# EasyEDA Pro project ADA4530_2025-03-15.epro, schematic Schematic3
Board Name: SiPD+运放+供电; Create Date: 2024-12-24; Page Name: P1; Project Name: yuhuiceshi; Schematic Name: Schematic3; Update Date: 2025-03-02; Company: 嘉立创EDA; Page Size: A4; Version: V1.0
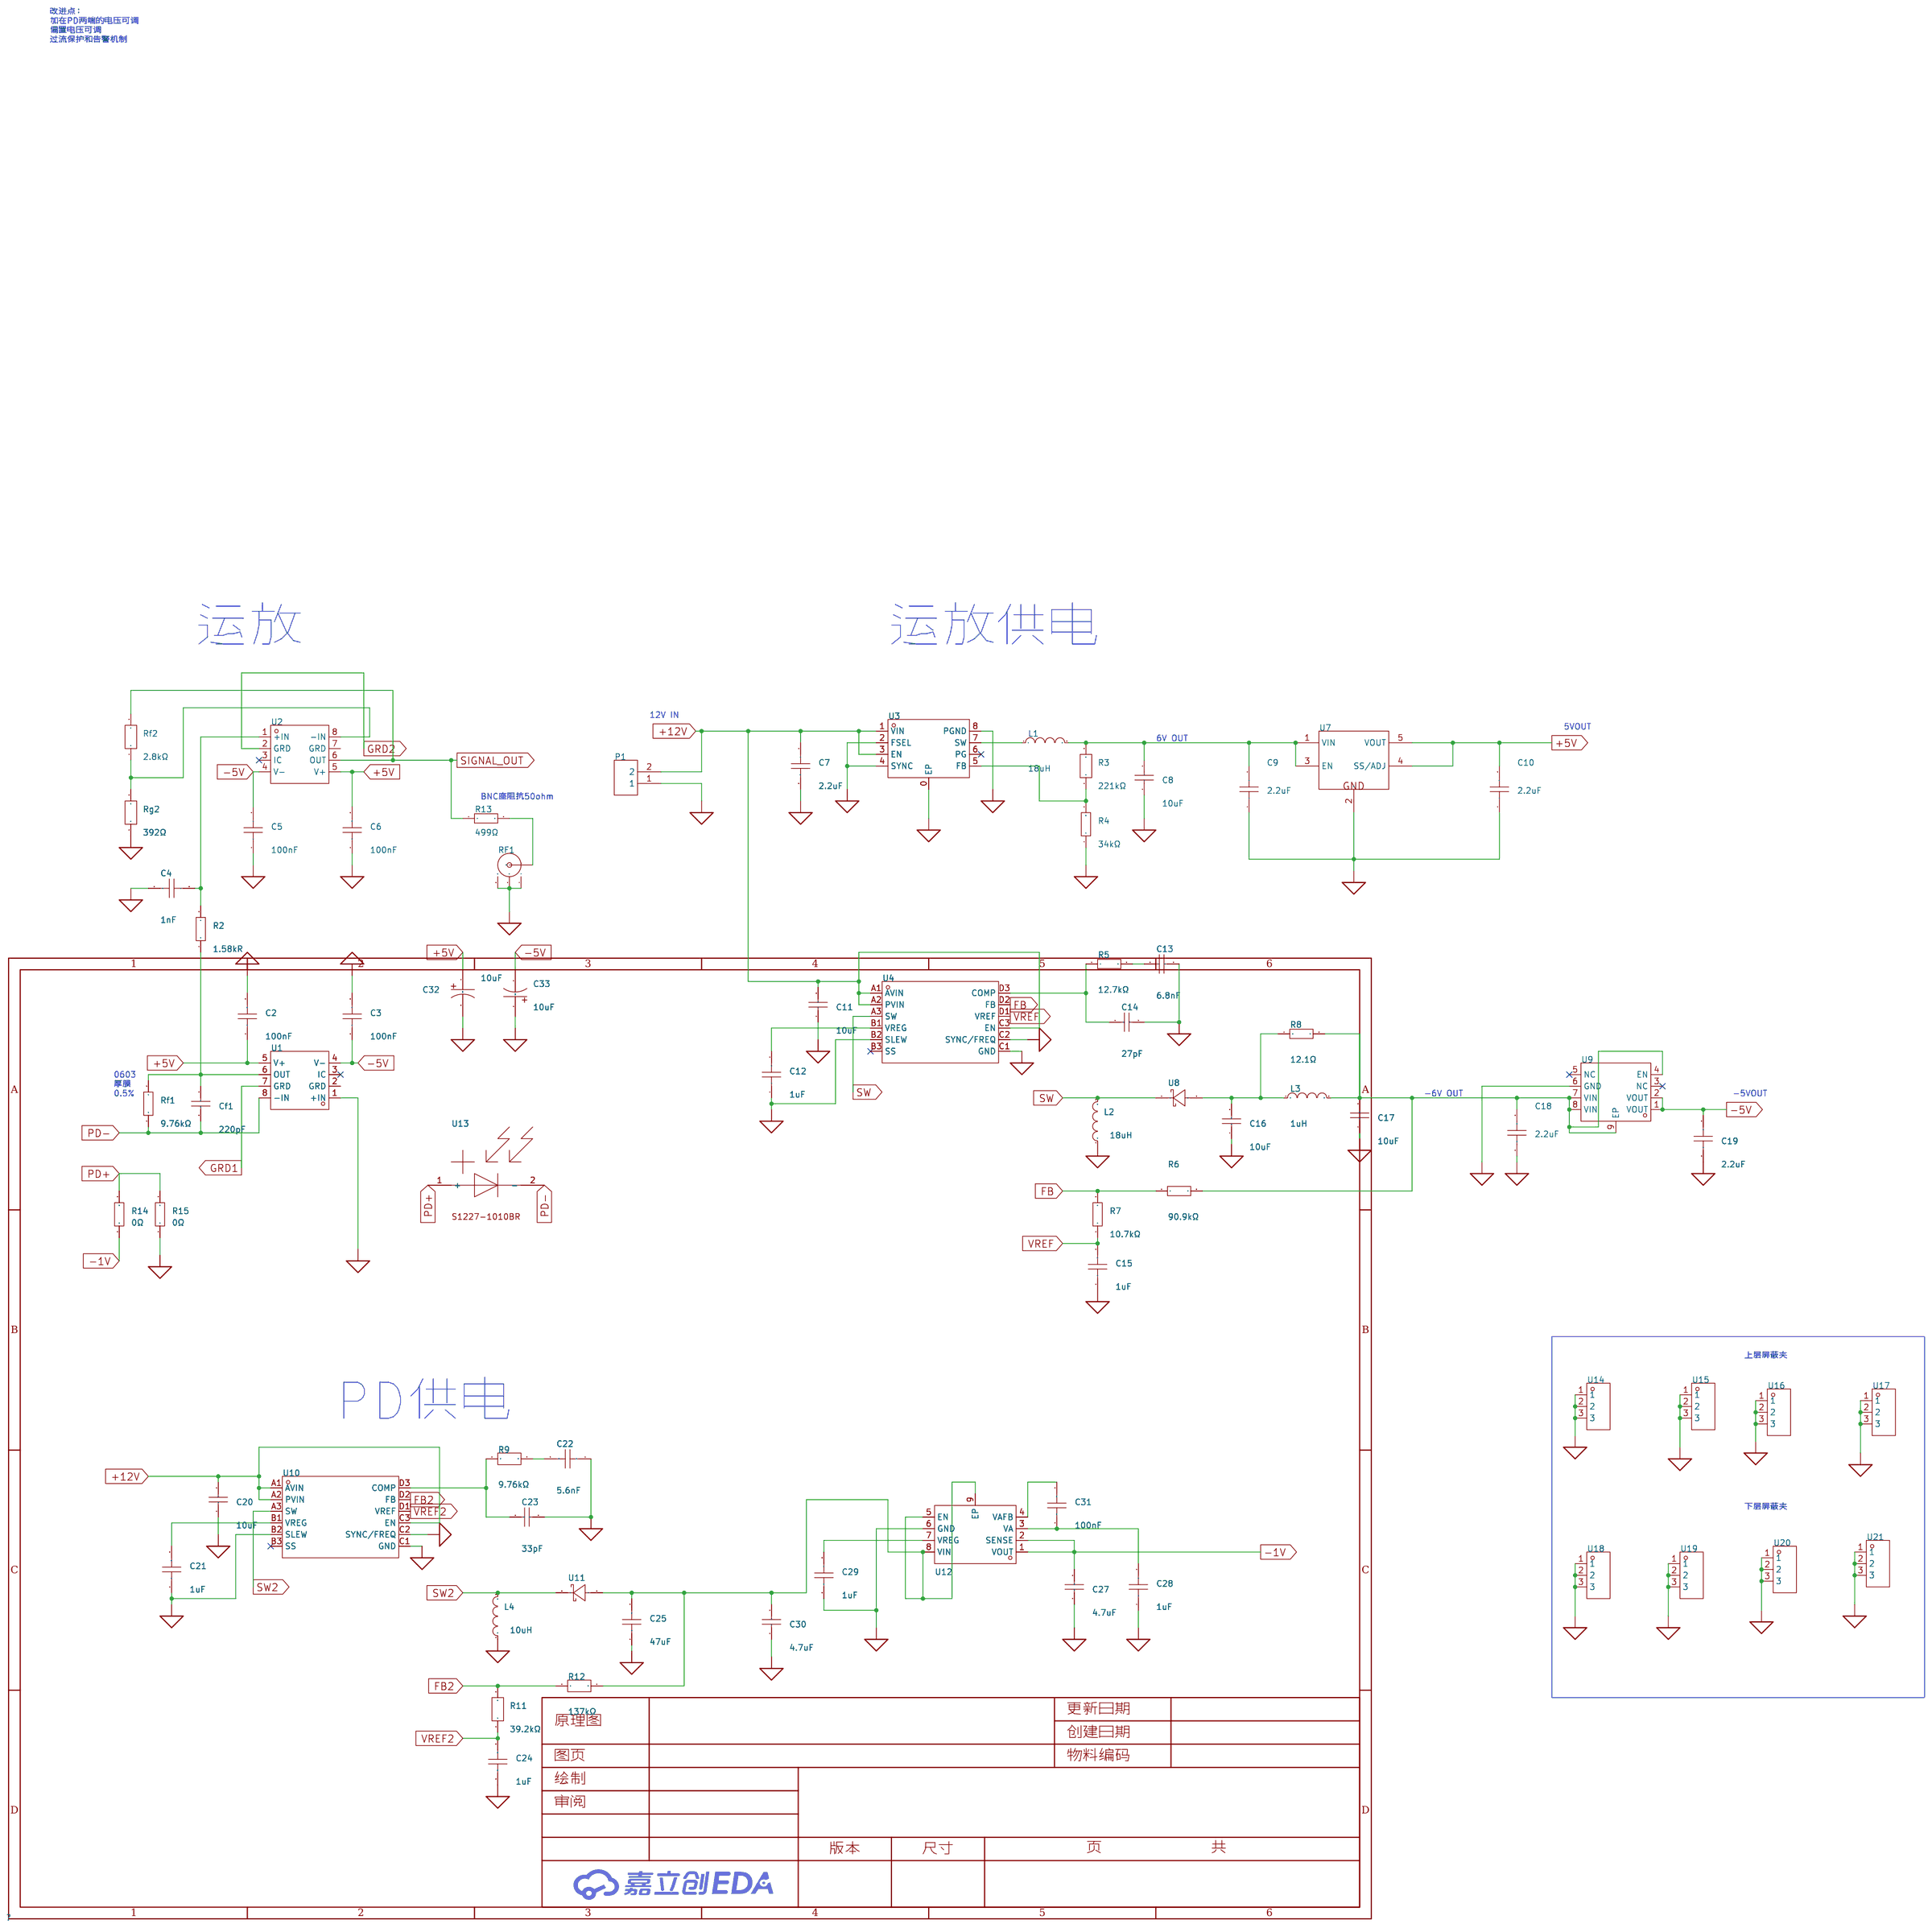
[diagram p3: schematic sheet]

## Parts
C2  100nF  [C0603]
C3  100nF  [C0603]
C4  1nF  [C0603]
C5  100nF  [C0603]
C6  100nF  [C0603]
C7  2.2uF  [C0805]
C8  10uF  [C1206]
C9  2.2uF  [C0805]
C10  2.2uF  [C0805]
C11  10uF  [C1206]
C12  1uF  [C0603]
C13  6.8nF  [C0402]
C14  27pF  [C0402]
C15  1uF  [C0603]
C16  10uF  [C1206]
C17  10uF  [C1206]
C18  2.2uF  [C0805]
C19  2.2uF  [C0805]
C20  10uF  [C1206]
C21  1uF  [C0603]
C22  5.6nF  [C0402]
C23  33pF  [C0402]
C24  1uF  [C0603]
C25  47uF  [C1206]
C27  4.7uF  [C0603]
C28  1uF  [C0603]
C29  1uF  [C0603]
C30  4.7uF  [C0603]
C31  100nF  [C0603]
C32  10uF  [CAP-SMD_L6.0-W3.2]
C33  10uF  [CAP-SMD_L6.0-W3.2]
Cf1  220pF  [C0603]
L1  18uH  [IND-SMD_L12.7-W12.7]
L2  18uH  [IND-SMD_L7.8-W7.0]
L3  1uH  [IND-SMD_L4.4-W4.2]
L4  10uH  [IND-SMD_L7.3-W6.8]
P1  WJ500V-5.08-2P  [CONN-TH_2P-P5.00_WJ500V-5.08-2P]
R2  1.58kR  [R0603]
R3  221kΩ  [R0603]
R4  34kΩ  [R0603]
R5  12.7kΩ  [R0402]
R6  90.9kΩ  [R0402]
R7  10.7kΩ  [R0402]
R8  12.1Ω  [R0402]
R9  9.76kΩ  [R0402]
R11  39.2kΩ  [R0402]
R12  137kΩ  [R0402]
R13  499Ω  [R0603]
R14  0Ω  [R0603]
R15  0Ω  [R0603]
RF1  KH-BNC50-3511  [ANT-TH_KH-BNC50-3511]
Rf1  9.76kΩ  [R0603]
Rf2  2.8kΩ  [R0603]
Rg2  392Ω  [R0603]
U1  ADA4530-1ARZ  [SOIC-8_L4.9-W3.9-P1.27-LS6.0-BL]
U2  ADA4530-1ARZ  [SOIC-8_L4.9-W3.9-P1.27-LS6.0-BL]
U3  ADP2370ACPZ-R7  [LFCSP-8_L3.0-W3.0-P0.50-BL-EP_ADP2370ACPZ-R7]
U4  ADP5075ACBZ-R7  [WLCSP-12_L2.2-W1.6_ADP5075ACBZ-R7]
U7  ADP7118AUJZ-5.0-R7  [SOT-23-5_L3.0-W1.7-P0.95-LS2.8-BR]
U8  MBR0520L  [SOD-123_L2.7-W1.6-LS3.7-RD-1]
U9  ADP7182ACPZ-5.0-R7  [LFCSP-8_L3.0-W3.0-P0.50-BL-EP-1]
U10  ADP5075ACBZ-R7  [WLCSP-12_L2.2-W1.6_ADP5075ACBZ-R7]
U11  MBR0520L  [SOD-123_L2.7-W1.6-LS3.7-RD-1]
U12  ADP7185ACPZN1.0-R7  [LFCSP-8_L2.0-W2.0-P0.50-BL-EP]
U13  -  [S1227-1010BR]
U14  ICSRC6508-030SFR  [SMD-3P_L6.5-W0.8_ICSRC6508-030SFR]
U15  ICSRC6508-030SFR  [SMD-3P_L6.5-W0.8_ICSRC6508-030SFR]
U16  ICSRC6508-030SFR  [SMD-3P_L6.5-W0.8_ICSRC6508-030SFR]
U17  ICSRC6508-030SFR  [SMD-3P_L6.5-W0.8_ICSRC6508-030SFR]
U18  ICSRC6508-030SFR  [SMD-3P_L6.5-W0.8_ICSRC6508-030SFR]
U19  ICSRC6508-030SFR  [SMD-3P_L6.5-W0.8_ICSRC6508-030SFR]
U20  ICSRC6508-030SFR  [SMD-3P_L6.5-W0.8_ICSRC6508-030SFR]
U21  ICSRC6508-030SFR  [SMD-3P_L6.5-W0.8_ICSRC6508-030SFR]

## Library data of the parts
C2 C3 C5 C6 C31 = CC0603KRX7R9BB104: 容值:100nF;精度:±10%;额定电压:50V;材质(温度系数):X7R;; LCSC Part Name: 100nF ±10% 50V; Supplier Part: C14663; Manufacturer: YAGEO(国巨); Supplier Footprint: 0603; JLCPCB Part Class: 基础库; Datasheet: https://atta.szlcsc.com/upload/public/pdf/source/20180910/C282072_33301C7F631E79921B82A8DAC6BCC5B3.pdf; Supplier: LCSC; Tolerance: ±10%; Voltage Rated: 50V; Temperature Coefficient: X7R
C4 = GRM1885C1H102JA01D: 容值:1nF;精度:±5%;额定电压:50V;材质(温度系数):C0G;; LCSC Part Name: 1nF ±5% 50V; Supplier Part: C77026; Manufacturer: muRata(村田); Supplier Footprint: 0603; JLCPCB Part Class: 扩展库; Datasheet: https://atta.szlcsc.com/upload/public/pdf/source/20200305/C490387_23319AE8C154DEB24C505E6C82A8106A.pdf; Supplier: LCSC; Tolerance: ±5%; Voltage Rated: 50V; Temperature Coefficient: C0G
C7 C9 C10 C18 C19 = CL21A225KBQNNNE: 容值:2.2uF;精度:±10%;额定电压:50V;材质(温度系数):X5R;; LCSC Part Name: 2.2uF ±10% 50V; Supplier Part: C377773; Manufacturer: SAMSUNG(三星); Supplier Footprint: 0805; JLCPCB Part Class: 基础库; Datasheet: https://atta.szlcsc.com/upload/public/pdf/source/20160218/1457707763339.pdf; Supplier: LCSC; Tolerance: ±10%; Voltage Rated: 50V; Temperature Coefficient: X5R
C8 C11 C16 C17 C20 = CL31A106KAHNNNE: 容值:10uF;精度:±10%;额定电压:25V;材质(温度系数):X5R;; LCSC Part Name: 10uF ±10% 25V; Supplier Part: C9807; Manufacturer: SAMSUNG(三星); Supplier Footprint: 1206; JLCPCB Part Class: 扩展库; Datasheet: https://atta.szlcsc.com/upload/public/pdf/source/20160218/1457707763339.pdf; Supplier: LCSC; Tolerance: ±10%; Voltage Rated: 25V; Temperature Coefficient: X5R
C12 C15 C21 C24 C28 C29 = CGA0603X5R105K160JT: 容值:1uF;精度:±10%;额定电压:16V;材质(温度系数):X5R;; LCSC Part Name: 1uF ±10% 16V; Supplier Part: C6119849; Manufacturer: HRE(芯声); Supplier Footprint: 0603; JLCPCB Part Class: 扩展库; Supplier: LCSC; Tolerance: ±10%; Voltage Rated: 16V; Temperature Coefficient: X5R
C13 = CC0402KRX7R9BB682: 容值:6.8nF;精度:±10%;额定电压:50V;材质(温度系数):X7R;; LCSC Part Name: 6.8nF ±10% 50V; Supplier Part: C93654; Manufacturer: YAGEO(国巨); Supplier Footprint: 0402; JLCPCB Part Class: 扩展库; Datasheet: https://atta.szlcsc.com/upload/public/pdf/source/20181008/C309510_22F155564471FAF6A489F7D68F34234E.pdf; Supplier: LCSC; Tolerance: ±10%; Voltage Rated: 50V; Temperature Coefficient: X7R
C14 = GCM1555C1H270JA16D: 容值:27pF;精度:±5%;额定电压:50V;材质(温度系数):C0G;; LCSC Part Name: 27pF ±5% 50V; Supplier Part: C126504; Manufacturer: muRata(村田); Supplier Footprint: 0402; JLCPCB Part Class: 扩展库; Datasheet: https://atta.szlcsc.com/upload/public/pdf/source/20170912/C126504_1505207897130963601.pdf; Supplier: LCSC; Tolerance: ±5%; Voltage Rated: 50V; Temperature Coefficient: C0G
C22 = CC0402KRX7R9BB562: 容值:5.6nF;精度:±10%;额定电压:50V;材质(温度系数):X7R;; LCSC Part Name: 5.6nF ±10% 50V; Supplier Part: C281760; Manufacturer: YAGEO(国巨); Supplier Footprint: 0402; JLCPCB Part Class: 扩展库; Datasheet: https://atta.szlcsc.com/upload/public/pdf/source/20180910/C282072_33301C7F631E79921B82A8DAC6BCC5B3.pdf; Supplier: LCSC; Tolerance: ±10%; Voltage Rated: 50V; Temperature Coefficient: X7R
C23 = CC0402JRNPO9BN330: 容值:33pF;精度:±5%;额定电压:50V;材质(温度系数):NP0;; LCSC Part Name: 33pF ±5% 50V; Supplier Part: C107005; Manufacturer: YAGEO(国巨); Supplier Footprint: 0402; JLCPCB Part Class: 扩展库; Datasheet: https://atta.szlcsc.com/upload/public/pdf/source/20181008/C309499_21CC21451B82C39E3D92150FD6B30293.pdf; Supplier: LCSC; Tolerance: ±5%; Voltage Rated: 50V; Temperature Coefficient: NP0
C25 = CGA1206X5R476M250NT: 容值:47uF;精度:±20%;额定电压:25V;材质(温度系数):X5R;; LCSC Part Name: 47uF ±20% 25V; Supplier Part: C6119973; Manufacturer: HRE(芯声); Supplier Footprint: 1206; JLCPCB Part Class: 扩展库; Datasheet: https://atta.szlcsc.com/upload/public/pdf/source/20240229/85D0248657B5565B358B20AFC8F32D04.pdf; Supplier: LCSC; Tolerance: ±20%; Voltage Rated: 25V; Temperature Coefficient: X5R
C27 C30 = CL10A475KO8NNNC: 容值:4.7uF;精度:±10%;额定电压:16V;材质(温度系数):X5R;; LCSC Part Name: 4.7uF ±10% 16V; Supplier Part: C19666; Manufacturer: SAMSUNG(三星); Supplier Footprint: 0603; JLCPCB Part Class: 基础库; Datasheet: https://atta.szlcsc.com/upload/public/pdf/source/20160218/1457707763339.pdf; Supplier: LCSC; Tolerance: ±10%; Voltage Rated: 16V; Temperature Coefficient: X5R
C32 C33 = TPSC106M025R0500: 容值:10uF;精度:±20%;额定电压:25V;等效串联电阻:500mΩ@100kHz;; LCSC Part Name: 10uF ±20% 25V; Supplier Part: C308883; Manufacturer: Kyocera AVX; Supplier Footprint: CASE-C-6032; JLCPCB Part Class: 扩展库; Datasheet: https://atta.szlcsc.com/upload/public/pdf/source/20190621/C308909_9D37C5E2EC8949438110162F4533A132.pdf; Supplier: LCSC; Tolerance: ±20%; Rated Voltage: 25V; Equivalent Series Resistance(ESR): 500mΩ@100kHz; Operating Temperature: -55℃~+125℃
Cf1 = CL10C221JB8NNNC: 容值:220pF;精度:±5%;额定电压:50V;材质(温度系数):C0G;; LCSC Part Name: 220pF ±5% 50V; Supplier Part: C27675; Manufacturer: SAMSUNG(三星); Supplier Footprint: 0603; JLCPCB Part Class: 扩展库; Datasheet: https://atta.szlcsc.com/upload/public/pdf/source/20160218/1457707763339.pdf; Supplier: LCSC; Tolerance: ±5%; Voltage Rated: 50V; Temperature Coefficient: C0G
L1 = SRR1208-180ML: 电感值:18uH;精度:±20%;额定电流:3.8A;饱和电流(Isat):4A;类型:-;; LCSC Part Name: 18uH ±20% 4A; Supplier Part: C1331002; Manufacturer: BOURNS; Supplier Footprint: SMD,12.7x12.7mm; JLCPCB Part Class: 扩展库; Datasheet: https://atta.szlcsc.com/upload/public/pdf/source/20210611/27EB3296191C192B2696E5AAF504BCA4.pdf; Supplier: LCSC; Tolerance: ±20%; Rated Current: 3.8A; Saturation Current (Isat): 4A; DC Resistance (DCR): 40mΩ
L2 = PCD0705MT180: 电感值:18uH;精度:±20%;额定电流:1.6A;; LCSC Part Name: 18uH ±20%; Supplier Part: C324432; Manufacturer: Viking(光颉); Supplier Footprint: SMD,7.8x7mm; JLCPCB Part Class: 扩展库; Datasheet: https://atta.szlcsc.com/upload/public/pdf/source/20190222/C324465_D652D0977146414A08B59C9C08C2344A.pdf; Supplier: LCSC; Tolerance: ±20%; Rated Current: 1.6A; DC Resistance (DCR): 100mΩ
L3 = FXL0420-1R0-M: 电感值:1uH;精度:±20%;额定电流:6A;饱和电流(Isat):7A;类型:一体成型电感;; LCSC Part Name: 1uH ±20% 7A; Supplier Part: C167203; Manufacturer: cjiang(长江微电); Supplier Footprint: SMD,4.2x4.4mm; JLCPCB Part Class: 扩展库; Datasheet: https://atta.szlcsc.com/upload/public/pdf/source/20240426/3189EA8206330E2108542F9E34E540E7.pdf; Supplier: LCSC; Tolerance: ±20%; Rated Current: 6A; Saturation Current (Isat): 7A; DC Resistance (DCR): 27mΩ; Type: 一体成型电感
L4 = FXL0630-100-M: 电感值:10uH;精度:±20%;额定电流:4.5A;饱和电流(Isat):5.5A;类型:一体成型电感;; LCSC Part Name: 10uH ±20% 5.5A; Supplier Part: C167223; Manufacturer: cjiang(长江微电); Supplier Footprint: SMD,6.6x7mm; JLCPCB Part Class: Extended Part; Datasheet: https://atta.szlcsc.com/upload/public/pdf/source/20240426/3189EA8206330E2108542F9E34E540E7.pdf; Supplier: LCSC; Tolerance: ±20%; Rated Current: 4.5A; Saturation Current (Isat): 5.5A; DC Resistance (DCR): 68mΩ; Type: 一体成型电感
P1 = WJ500V-5.08-2P: 结构:1x2P;间距:5.08mm;颜色:绿色;安装方式:直插;额定电流:18A;额定电压:250V;排数:1;线规 - AWG:14~30;线规 - 平方毫米:2.5;每排PIN数:2;触头材质:-;触头镀层:-;工作温度范围:-40℃~+105℃;焊接温度(最大值):-;; LCSC Part Name: 1x2P 5.08mm 直插 排数:1 每排P数:2; Supplier Part: C8465; Manufacturer: KANGNEX(康奈克斯电气); Supplier Footprint: 插件,P=5.08mm; JLCPCB Part Class: 扩展库; Datasheet: https://atta.szlcsc.com/upload/public/pdf/source/20191225/C8465_02D34CE5B5B4A53DF5891601D97FA9F4.pdf; Supplier: LCSC; Structure: 1x2P; Pitch: 5.08mm; Color: 绿色; Mounting Style: 直插; Current Rating (Max): 18A; Voltage Rating (Max): 250V; Number of Pins: 2P; Number of Rows: 1; Wire Gauge - AWG: 14~30; Wire Gauge - mm2: 2.5; Number of PINs Per Row: 2; Operating Temperature Range: -40℃~+105℃; Screw Specification: M2.5
R2 = Res_0603: 0.5%; Supplier Footprint: 0603; Supplier Part: C861202
R3 = FRC0603F2213TS: 电阻类型:厚膜电阻;阻值:221kΩ;精度:±1%;功率:100mW;温度系数:±100ppm/℃;; LCSC Part Name: 厚膜电阻 221kΩ ±1% 100mW; Supplier Part: C7467463; Manufacturer: FOJAN(富捷); Supplier Footprint: 0603; JLCPCB Part Class: 扩展库; Datasheet: https://atta.szlcsc.com/upload/public/pdf/source/20211221/9022FBEBBD509006A57EBC43C1F2F40C.pdf; Supplier: LCSC; Type: 厚膜电阻; Tolerance: ±1%; Power(Watts): 100mW; Temperature Coefficient: ±100ppm/℃
R4 = 0603WAF3402T5E: 电阻类型:厚膜电阻;阻值:34kΩ;精度:±1%;功率:100mW;最大工作电压:75V;温度系数:±100ppm/℃;; LCSC Part Name: 34kΩ ±1% 100mW 厚膜电阻; Supplier Part: C23008; Manufacturer: UNI-ROYAL(厚声); Supplier Footprint: 0603; JLCPCB Part Class: 扩展库; Datasheet: https://atta.szlcsc.com/upload/public/pdf/source/20200306/C422600_1E6D84923E4A46A82E41ADD87F860B5C.pdf; Supplier: LCSC; Type: 厚膜电阻; Tolerance: ±1%; Power(Watts): 100mW; Overload Voltage (Max): 75V; Temperature Coefficient: ±100ppm/℃; Operating Temperature Range: -55℃~+155℃
R5 = 0402WGF1272TCE: 电阻类型:厚膜电阻;阻值:12.7kΩ;精度:±1%;功率:62.5mW;最大工作电压:50V;温度系数:±100ppm/℃;; LCSC Part Name: 12.7kΩ ±1% 62.5mW 厚膜电阻; Supplier Part: C25853; Manufacturer: UNI-ROYAL(厚声); Supplier Footprint: 0402; JLCPCB Part Class: 扩展库; Datasheet: https://atta.szlcsc.com/upload/public/pdf/source/20200306/C422600_1E6D84923E4A46A82E41ADD87F860B5C.pdf; Supplier: LCSC; Type: 厚膜电阻; Tolerance: ±1%; Power(Watts): 62.5mW; Overload Voltage (Max): 50V; Temperature Coefficient: ±100ppm/℃; Operating Temperature Range: -55℃~+155℃
R6 = RC0402FR-0790K9L: 电阻类型:厚膜电阻;阻值:90.9kΩ;精度:±1%;功率:62.5mW;最大工作电压:50V;温度系数:±100ppm/℃;; LCSC Part Name: 厚膜电阻 90.9kΩ ±1% 62.5mW; Supplier Part: C163452; Manufacturer: YAGEO(国巨); Supplier Footprint: 0402; JLCPCB Part Class: 扩展库; Datasheet: https://atta.szlcsc.com/upload/public/pdf/source/20181009/C309620_DA5935B6E1D48212CB7A533FE518B3C2.pdf; Supplier: LCSC; Type: 厚膜电阻; Tolerance: ±1%; Power(Watts): 62.5mW; Overload Voltage (Max): 50V; Temperature Coefficient: ±100ppm/℃; Operating Temperature Range: -55℃~+155℃
R7 = 0402WGF1072TCE: 电阻类型:厚膜电阻;阻值:10.7kΩ;精度:±1%;功率:62.5mW;最大工作电压:50V;温度系数:±100ppm/℃;; LCSC Part Name: 10.7kΩ ±1% 62.5mW 厚膜电阻; Supplier Part: C270654; Manufacturer: UNI-ROYAL(厚声); Supplier Footprint: 0402; JLCPCB Part Class: 扩展库; Datasheet: https://atta.szlcsc.com/upload/public/pdf/source/20200306/C422600_1E6D84923E4A46A82E41ADD87F860B5C.pdf; Supplier: LCSC; Type: 厚膜电阻; Tolerance: ±1%; Power(Watts): 62.5mW; Overload Voltage (Max): 50V; Temperature Coefficient: ±100ppm/℃; Operating Temperature Range: -55℃~+155℃
R8 = AC0402FR-0712R1L: 电阻类型:厚膜电阻;阻值:12.1Ω;精度:±1%;功率:62.5mW;最大工作电压:50V;温度系数:±100ppm/℃;; LCSC Part Name: 厚膜电阻 12.1Ω ±1% 62.5mW; Supplier Part: C226768; Manufacturer: YAGEO(国巨); Supplier Footprint: 0402; JLCPCB Part Class: 扩展库; Datasheet: https://atta.szlcsc.com/upload/public/pdf/source/20181031/C226768_6114F9BCF748DBB633F0F1931C76F1E7.pdf; Supplier: LCSC; Type: 厚膜电阻; Tolerance: ±1%; Power(Watts): 62.5mW; Overload Voltage (Max): 50V; Temperature Coefficient: ±100ppm/℃; Operating Temperature Range: -55℃~+155℃
R9 = FRC0402F9761TS: 电阻类型:厚膜电阻;阻值:9.76kΩ;精度:±1%;功率:62.5mW;最大工作电压:50V;温度系数:±100ppm/℃;; LCSC Part Name: 9.76kΩ ±1% 62.5mW 厚膜电阻; Supplier Part: C2998101; Manufacturer: FOJAN(富捷); Supplier Footprint: 0402; JLCPCB Part Class: 扩展库; Datasheet: https://atta.szlcsc.com/upload/public/pdf/source/20211221/925EC7D7225764EE0046F22065062C87.pdf; Supplier: LCSC; Type: 厚膜电阻; Tolerance: ±1%; Power(Watts): 62.5mW; Overload Voltage (Max): 50V; Temperature Coefficient: ±100ppm/℃; Operating Temperature Range: -55℃~+155℃
R11 = FRC0402F3922TS: 电阻类型:厚膜电阻;阻值:39.2kΩ;精度:±1%;功率:62.5mW;温度系数:±100ppm/℃;; LCSC Part Name: 厚膜电阻 39.2kΩ ±1% 62.5mW; Supplier Part: C7467415; Manufacturer: FOJAN(富捷); Supplier Footprint: 0402; JLCPCB Part Class: 扩展库; Datasheet: https://atta.szlcsc.com/upload/public/pdf/source/20211221/9022FBEBBD509006A57EBC43C1F2F40C.pdf; Supplier: LCSC; Type: 厚膜电阻; Tolerance: ±1%; Power(Watts): 62.5mW; Temperature Coefficient: ±100ppm/℃
R12 = FRC0402F1373TS: 电阻类型:厚膜电阻;阻值:137kΩ;精度:±1%;功率:62.5mW;最大工作电压:50V;温度系数:±100ppm/℃;; LCSC Part Name: 137kΩ ±1% 62.5mW 厚膜电阻; Supplier Part: C5153963; Manufacturer: FOJAN(富捷); Supplier Footprint: 0402; JLCPCB Part Class: 扩展库; Datasheet: https://atta.szlcsc.com/upload/public/pdf/source/20211221/925EC7D7225764EE0046F22065062C87.pdf; Supplier: LCSC; Type: 厚膜电阻; Tolerance: ±1%; Power(Watts): 62.5mW; Overload Voltage (Max): 50V; Temperature Coefficient: ±100ppm/℃
R13 = 0603WAF4990T5E: 电阻类型:厚膜电阻;阻值:499Ω;精度:±1%;功率:100mW;最大工作电压:75V;温度系数:±100ppm/℃;; LCSC Part Name: 499Ω ±1% 100mW 厚膜电阻; Supplier Part: C23065; Manufacturer: UNI-ROYAL(厚声); Supplier Footprint: 0603; JLCPCB Part Class: 扩展库; Datasheet: https://atta.szlcsc.com/upload/public/pdf/source/20200306/C422600_1E6D84923E4A46A82E41ADD87F860B5C.pdf; Supplier: LCSC; Type: 厚膜电阻; Tolerance: ±1%; Power(Watts): 100mW; Overload Voltage (Max): 75V; Temperature Coefficient: ±100ppm/℃; Operating Temperature Range: -55℃~+155℃
R14 R15 = 0603WAF0000T5E: 电阻类型:厚膜电阻;阻值:0Ω;精度:±1%;功率:100mW;最大工作电压:75V;; LCSC Part Name: 0Ω ±1% 100mW 厚膜电阻; Supplier Part: C21189; Manufacturer: UNI-ROYAL(厚声); Supplier Footprint: 0603; JLCPCB Part Class: 基础库; Datasheet: https://atta.szlcsc.com/upload/public/pdf/source/20200306/C422600_1E6D84923E4A46A82E41ADD87F860B5C.pdf; Supplier: LCSC; Type: 厚膜电阻; Tolerance: ±1%; Power(Watts): 100mW; Overload Voltage (Max): 75V; Operating Temperature Range: -55℃~+155℃
RF1 = KH-BNC50-3511: 连接器类型:板端;接口类型:内孔;端口数量:1;接口直径:9.5mm;接口长度/高度:-;频率-最大值:3GHz;射频系列:BNC;阻抗:50Ω;样式:弯头;工作温度范围:-55℃~+155℃;; LCSC Part Name: BNC 内孔 弯头; Supplier Part: C2837587; Manufacturer: kinghelm(金航标); Supplier Footprint: 插件; JLCPCB Part Class: 扩展库; Datasheet: https://atta.szlcsc.com/upload/public/pdf/source/20221123/AFF24A942BB0EF6B7776F494013BE75C.pdf; Supplier: LCSC; Connector Type: 板端; Interface Type: 内孔; Number of Ports: 1; Interface Diameter: 9.5mm; Frequency-Max: 3GHz; RF Series: BNC; Impedance: 50Ω; Style: 弯头; Operating Temperature Range: -55℃~+155℃
Rf1 = 0603WAF9761T5E: 电阻类型:厚膜电阻;阻值:9.76kΩ;精度:±1%;功率:100mW;最大工作电压:75V;温度系数:±100ppm/℃;; LCSC Part Name: 9.76kΩ ±1% 100mW 厚膜电阻; Supplier Part: C23128; Manufacturer: UNI-ROYAL(厚声); Supplier Footprint: 0603; JLCPCB Part Class: Extended Part; Datasheet: https://atta.szlcsc.com/upload/public/pdf/source/20200306/C422600_1E6D84923E4A46A82E41ADD87F860B5C.pdf; Supplier: LCSC; Type: 厚膜电阻; Tolerance: ±1%; Power(Watts): 100mW; Overload Voltage (Max): 75V; Temperature Coefficient: ±100ppm/℃; Operating Temperature Range: -55℃~+155℃
Rf2 = FRC0603F2801TS: 电阻类型:厚膜电阻;阻值:2.8kΩ;精度:±1%;功率:100mW;最大工作电压:75V;温度系数:±100ppm/℃;; LCSC Part Name: 2.8kΩ ±1% 100mW 厚膜电阻; Supplier Part: C2933188; Manufacturer: FOJAN(富捷); Supplier Footprint: 0603; JLCPCB Part Class: Extended Part; Datasheet: https://atta.szlcsc.com/upload/public/pdf/source/20211221/925EC7D7225764EE0046F22065062C87.pdf; Supplier: LCSC; Type: 厚膜电阻; Tolerance: ±1%; Power(Watts): 100mW; Overload Voltage (Max): 75V; Temperature Coefficient: ±100ppm/℃; Operating Temperature Range: -55℃~+155℃
Rg2 = FRC0603F2801TS: 电阻类型:厚膜电阻;阻值:2.8kΩ;精度:±1%;功率:100mW;最大工作电压:75V;温度系数:±100ppm/℃;; LCSC Part Name: 2.8kΩ ±1% 100mW 厚膜电阻; Supplier Part: C5126126; Manufacturer: FOJAN(富捷); Manufacturer Part: FRC0603F3920TS; Supplier Footprint: 0603; JLCPCB Part Class: Extended Part; Datasheet: https://atta.szlcsc.com/upload/public/pdf/source/20211221/925EC7D7225764EE0046F22065062C87.pdf; Supplier: LCSC; Type: 厚膜电阻; Tolerance: ±1%; Power(Watts): 100mW; Overload Voltage (Max): 75V; Temperature Coefficient: ±100ppm/℃; Operating Temperature Range: -55℃~+155℃
U1 U2 = ADA4530-1ARZ: 放大器数:单路;轨到轨:轨到轨输出;增益带宽积(GBP):2MHz;输入失调电压(Vos):300uV;压摆率(SR):1.4V/us;输入偏置电流(Ib):0.02pA;; LCSC Part Name: 飞安级输入偏置电流静电计放大器; Supplier Part: C654128; Manufacturer: ADI(亚德诺); Supplier Footprint: SOIC-8; JLCPCB Part Class: 扩展库; Datasheet: https://atta.szlcsc.com/upload/public/pdf/source/20200729/C654128_C8802637E08A58373167ED8215F15F2A.pdf; Supplier: LCSC; Number of Circuits: 单路; Maximum Power Supply Range (Vdd-Vss): 16V; Rail to Rail: 轨到轨输出; Gain Bandwidth Product(GBP): 2MHz; Voltage - Input Offset(Vos): 300uV; Input Offset Voltage Drift (Vos TC): 2.8uV/℃; Slew Rate(SR): 1.4V/us; Current - Input Bias(Ib): 0.02pA; Noise density(eN): 14nV/√Hz@10kHz; Common Mode Rejection Ratio (CMRR): 114dB; Output Current: 15mA; Operating Temperature: -40℃~+125℃
U3 = ADP2370ACPZ-R7: 功能类型:降压型;输出类型:可调;工作电压:3.2V~15V;输出电压:-;输出电流:800mA;; LCSC Part Name: 800mA、低静态电流降压调节器; Supplier Part: C481882; Manufacturer: ADI(亚德诺); Supplier Footprint: LFCSP-8-WD(3x3); JLCPCB Part Class: 扩展库; Datasheet: https://atta.szlcsc.com/upload/public/pdf/source/20200113/C481882_3242BD049A7F7733653B76B10E6A9D8D.pdf; Supplier: LCSC; Function: 降压型; Output Type: 可调; Input Voltage: 3.2V~15V; Output Current: 800mA; Operating Temperature: -40℃~+125℃; Number of Outputs: 1; Topology: 降压式; Switch tube (built-in/external): 内置
U4 U10 = ADP5075ACBZ-R7: 功能类型:-;输出类型:可调;工作电压:2.85V~15V;输出电压:-;输出电流:-;; LCSC Part Name: 800mA反相直流到直流转换器; Supplier Part: C659273; Manufacturer: ADI(亚德诺); Supplier Footprint: WLCSP-12(1.6x2.2); JLCPCB Part Class: 扩展库; Datasheet: https://atta.szlcsc.com/upload/public/pdf/source/20220408/32D5C5004668D0D8248B924B66BCE73F.pdf; Supplier: LCSC; Output Type: 可调; Input Voltage: 2.85V~15V; Operating Temperature: -40℃~+125℃; Number of Outputs: 1; Topology: 反相式
U7 = ADP7118AUJZ-5.0-R7: 输出类型:固定;最大输入电压:20V;输出电压:5V;最大输出电流:200mA;输出极性:正极;; Supplier Part: C141943; Manufacturer: ADI(亚德诺); Supplier Footprint: TSOT-23-5; JLCPCB Part Class: 扩展库; Datasheet: https://atta.szlcsc.com/upload/public/pdf/source/20180628/C194022_239F12D87A493F0A2DF0E3CFBC8CAC3D.pdf; Supplier: LCSC; Output Type: 固定; Maximum Input Voltage: 20V; Output Voltage: 5V; MAX Output Current: 200mA; Dropout Voltage: 420mV@(200mA); standby current: 140uA; Operating Temperature: -40℃~+125℃@(Ta); Output Polarity: 正极; Number of Outputs: 1
U8 U11 = MBR0520L_C5563735: 二极管配置:独立式;正向压降(Vf):385mV@500mA;直流反向耐压(Vr):20V;平均整流电流(Io):500mA;; LCSC Part Name: 电压:20V 电流:500mA; Supplier Part: C5563735; Manufacturer: FUXINSEMI(富芯森美); Supplier Footprint: SOD-123; JLCPCB Part Class: 扩展库; Datasheet: https://atta.szlcsc.com/upload/public/pdf/source/20230428/8DB0D38310962A125AA75EC8FEE231FE.pdf; Supplier: LCSC; Diode Configuration: 独立式; Forward Voltage (Vf@If): 385mV@500mA; Reverse Voltage (Vr): 20V; Average Rectified Current (Io): 500mA; Reverse Leakage Current (Ir): 250uA@20V
U9 = ADP7182ACPZ-5.0-R7: 输出类型:固定;最大输入电压:28V;输出电压:5V;最大输出电流:200mA;输出极性:负极;; Supplier Part: C579271; Manufacturer: ADI(亚德诺); Supplier Footprint: LFCSP-8(3x3); JLCPCB Part Class: 扩展库; Datasheet: https://atta.szlcsc.com/upload/public/pdf/source/20221018/D0A79D14B918B9E80473192889717AD6.pdf; Supplier: LCSC; Output Type: 固定; Maximum Input Voltage: 28V; Output Voltage: 5V; MAX Output Current: 200mA; Dropout Voltage: 360mV@(200mA); standby current: 53uA; Operating Temperature: -40℃~+125℃; Output Polarity: 负极; Number of Outputs: 1
U12 = ADP7185ACPZN1.0-R7: 输出类型:固定;最大输入电压:5.5V;输出电压:1V;最大输出电流:500mA;输出极性:负极;; Supplier Part: C659419; Manufacturer: ADI(亚德诺); Supplier Footprint: LFCSP-8(2x2); JLCPCB Part Class: 扩展库; Datasheet: https://atta.szlcsc.com/upload/public/pdf/source/20180524/C206738_0D4303CA62EFE81126E5929588CEAFCE.pdf; Supplier: LCSC; Output Type: 固定; Maximum Input Voltage: 5.5V; Output Voltage: 1V; MAX Output Current: 500mA; Dropout Voltage: 360mV@(500mA); standby current: 900uA; Operating Temperature: -40℃~+125℃@(Tj); Output Polarity: 负极; Number of Outputs: 1
U13 = SiPD: Check: false
U14-U21 = ICSRC6508-030SFR: LCSC Part Name: ICT，屏蔽罩支架 ，长6.5mm*高1.22mm，ICSRC6508-030SFR; Supplier Part: C2836609; Manufacturer: ICT; JLCPCB Part Class: 扩展库; Datasheet: https://atta.szlcsc.com/upload/public/pdf/source/20210602/C2836609_409FAF567EA6B9C2A2784FB7CF83EF0D.pdf; Supplier: LCSC; brand: ICT; size: 6.5mmx1.22m

## Nets
+5V: C2.1 C6.2 C10.2 C32.1 U1.5(V+) U2.5(V+) U7.4(SS/ADJ) U7.5(VOUT)
+12V: C7.1 C11.2 C20.2 P1.2 U3.1(VIN) U3.3(EN) U4.A1(AVIN) U4.A2(PVIN) U4.C3(EN) U10.A1(AVIN) U10.A2(PVIN) U10.C3(EN)
-1V: C27.2 R14.1 U12.1(VOUT) U12.2(SENSE)
-5V: C3.1 C5.2 C19.2 C33.2 U1.4(V-) U2.4(V-) U9.1(VOUT) U9.2(VOUT)
AGND: C2.2 C3.2 C4.1 C5.1 C6.1 C7.2 C8.1 C9.1 C10.1 C11.1 C12.1 C13.2 C14.2 C15.1 C16.1 C17.1 C18.1 C19.1 C20.1 C21.1 C22.1 C23.2 C24.1 C25.1 C27.1 C28.1 C29.1 C30.1 C32.2 C33.1 L2.1 L4.1 P1.1 R4.1 R15.1 RF1.2 RF1.3 RF1.4 Rg2.1 U1.1(+IN) U3.0(EP) U3.2(FSEL) U3.4(SYNC) U3.8(PGND) U4.B2(SLEW) U4.C1(GND) U4.C2(SYNC/FREQ) U7.2(GND) U9.6(GND) U10.B2(SLEW) U10.C1(GND) U10.C2(SYNC/FREQ) U12.6(GND) U14.1 U14.2 U14.3 U15.1 U15.2 U15.3 U16.1 U16.2 U16.3 U17.1 U17.2 U17.3 U18.1 U18.2 U18.3 U19.1 U19.2 U19.3 U20.1 U20.2 U20.3 U21.1 U21.2 U21.3
FB: R6.1 R7.2 U4.D2(FB)
FB2: R11.2 R12.1 U10.D2(FB)
GRD1: U1.7(GRD)
GRD2: U2.2(GRD)
PD+: R14.2 R15.2 U13.1(+)
PD-: Cf1.1 Rf1.1 U1.8(-IN) U13.2(-)
SIGNAL_OUT: R13.1 Rf2.2 U2.6(OUT)
SW: L2.2 U4.A3(SW) U8.1
SW2: L4.2 U10.A3(SW) U11.1
VREF: C15.2 R7.1 U4.D1(VREF)
VREF2: C24.2 R11.1 U10.D1(VREF)
$1N373: Cf1.2 R2.1 Rf1.2 U1.6(OUT)
$1N731: C4.2 R2.2 U2.1(+IN)
$1N896: Rf2.1 Rg2.2 U2.8(-IN)
$1N1826: C8.2 C9.2 L1.2 R3.2 U7.1(VIN) U7.3(EN)
$1N1986: L1.1 U3.7(SW)
$1N3114: C12.2 U4.B1(VREG)
$1N3352: C13.1 R5.2
$1N3356: C14.1 R5.1 U4.D3(COMP)
$1N4287: C16.2 L3.1 R8.1 U8.2
$1N4478: C17.2 C18.2 L3.2 R6.2 R8.2 U9.4(EN) U9.7(VIN) U9.8(VIN) U9.9(EP)
$1N6954: C22.2 R9.2
$1N6955: C23.1 R9.1 U10.D3(COMP)
$1N8371: C25.2 C30.2 R12.2 U11.2 U12.5(EN) U12.8(VIN) U12.9(EP)
$1N8567: C28.2 C31.1 U12.3(VA)
$1N8625: C29.2 U12.7(VREG)
$1N8812: C31.2 U12.4(VAFB)
$1N16099: R3.1 R4.2 U3.5(FB)
$1N25161: R13.2 RF1.1(OUT)
$1N25879: C21.2 U10.B1(VREG)

Not connected (* = marked no-connect by the designer): U1 2(GRD) 3(IC)*; U2 3(IC)* 7(GRD); U3 6(PG)*; U4 B3(SS)*; U9 3(NC)* 5(NC)*; U10 B3(SS)*

## Notes on the sheet
- 改进点：
  加在PD两端的电压可调
  偏置电压可调
  过流保护和告警机制
- 运放
- 运放供电
- 12V IN
- 5VOUT
- 6V OUT
- BNC座阻抗50ohm
- 0603
  厚膜
  0.5%
- -6V OUT
- -5VOUT
- 上层屏蔽夹
- PD供电
- 下层屏蔽夹
